# EAGLE design Domino Single Ethernet (EAGLE 6.5.0)
DATABASE: ./../Common/BOM/Domino_DB.txt; DRAWN: M.STEMPIN; REV: E
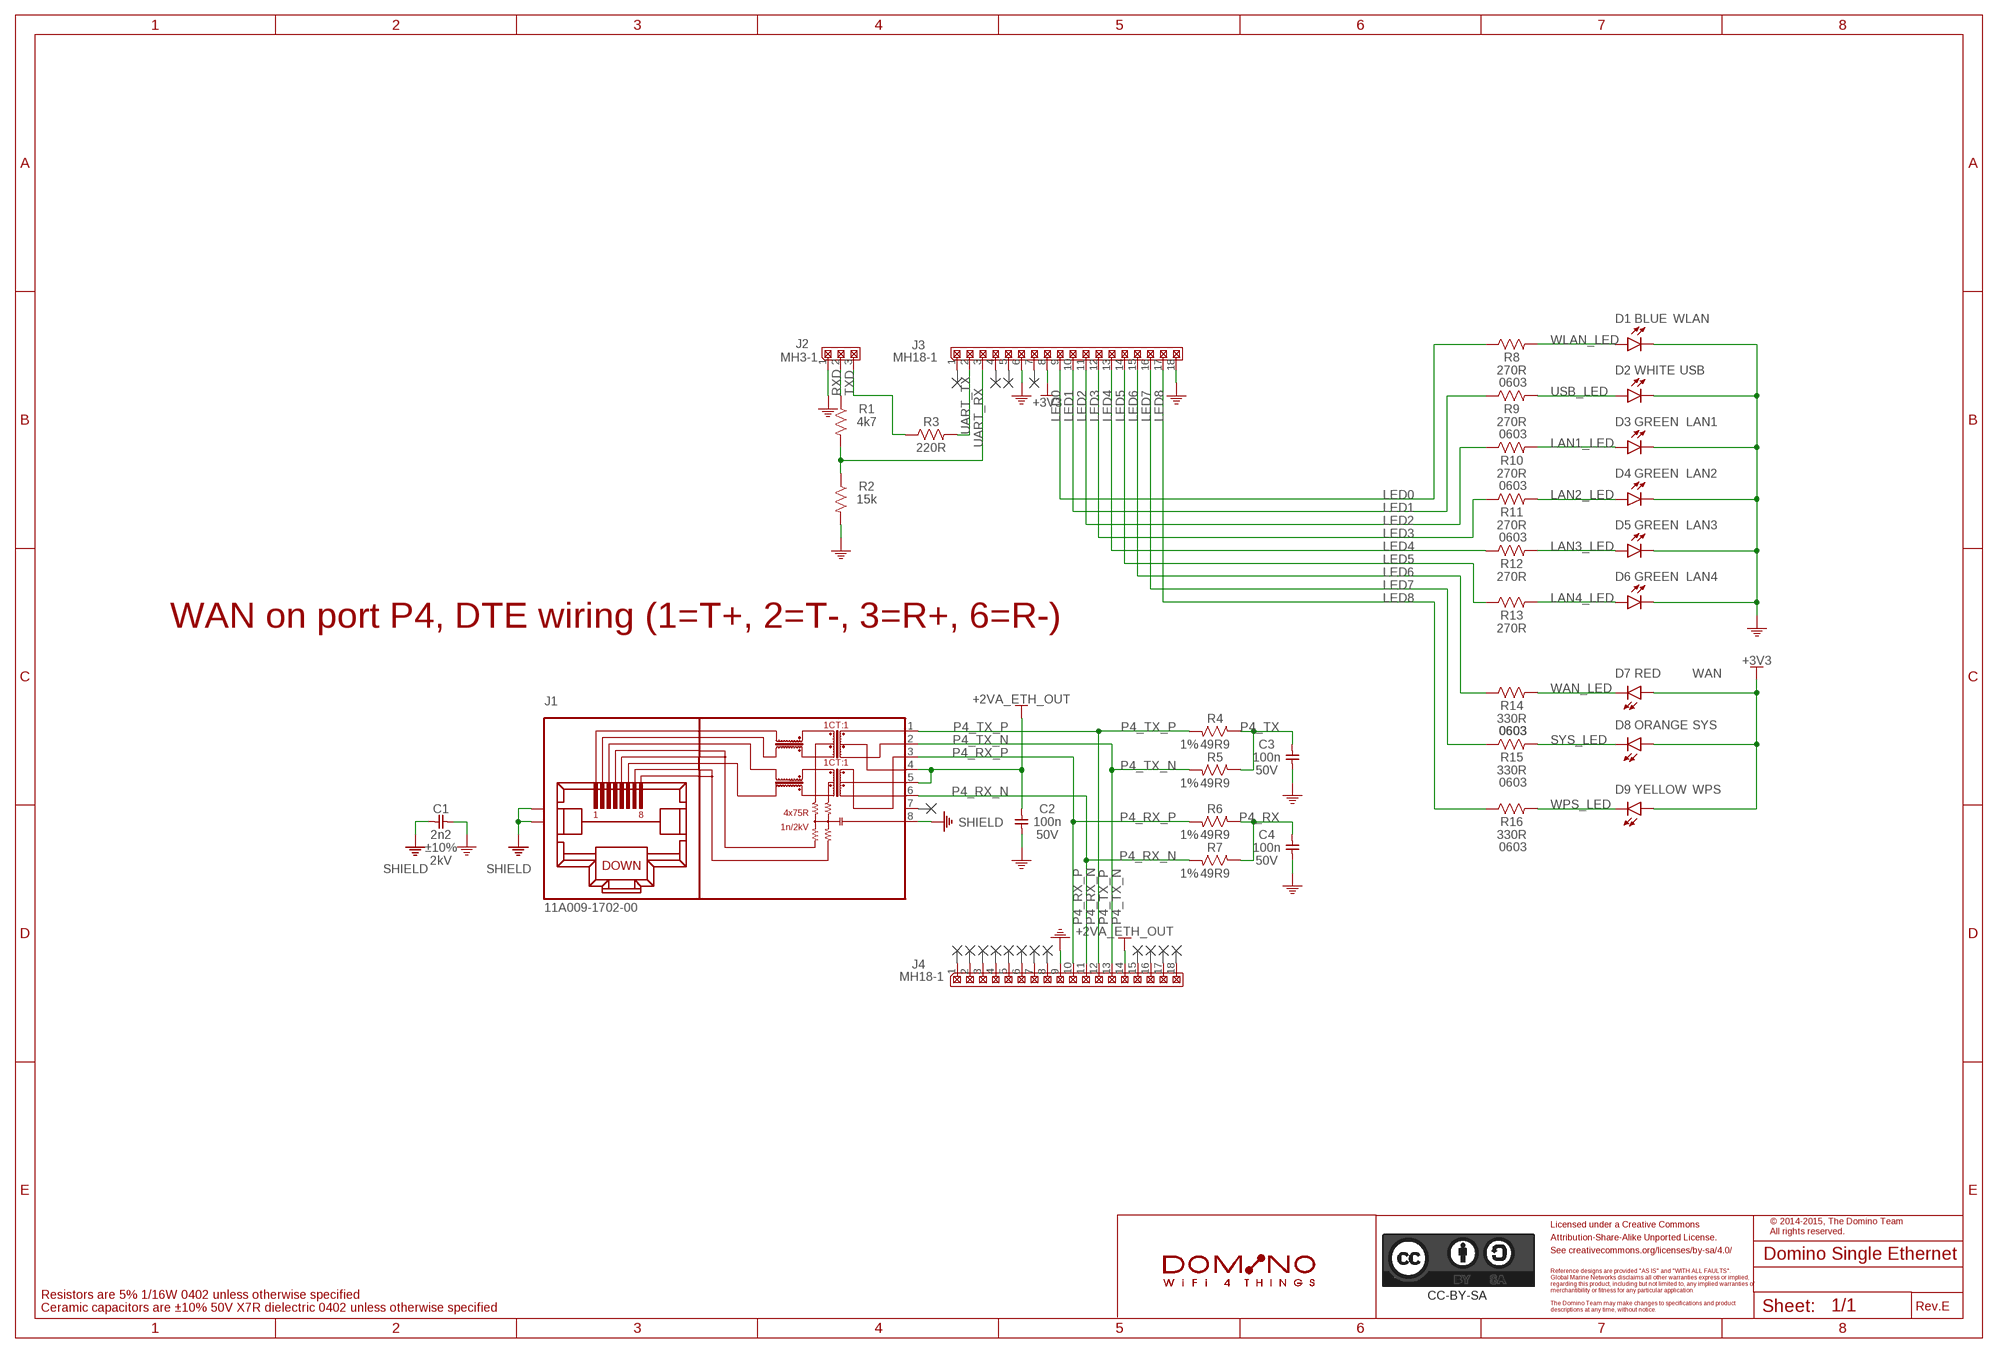
[diagram p0: schematic, sheet 1]
PORT1 (NC): BOM: EXCLUDE
PORT2 (NC): BOM: EXCLUDE
PORT3 (NC): BOM: EXCLUDE
PORT4 (NC): BOM: EXCLUDE
PORT5 (NC): BOM: EXCLUDE
PORT6 (NC): BOM: EXCLUDE
PORT7 (NC): BOM: EXCLUDE
PORT8 (NC): BOM: EXCLUDE
PORT9 (NC): BOM: EXCLUDE
PORT12 (NC): BOM: EXCLUDE
PORT13 (NC): BOM: EXCLUDE
PORT15 (NC): BOM: EXCLUDE
PORT16 (NC): BOM: EXCLUDE
PORT17 (NC): BOM: EXCLUDE
PORT18 (NC): BOM: EXCLUDE
PORT19 (NC): BOM: EXCLUDE
PORT20 (NC): BOM: EXCLUDE

## Parts
C1  2n2  CAP_1206  [C1206]
C2  100n  CAP_0402  [C0402]
C3  100n  CAP_0402  [C0402]
C4  100n  CAP_0402  [C0402]
CC-BY-SA1  CC-BY-SA_LOGO  [CC-BY-SA_LOGO]
D1  BLUE  LED_0603  [LED0603]
D2  WHITE  LED_0603  [LED0603]
D3  GREEN  LED_0603  [LED0603]
D4  GREEN  LED_0603  [LED0603]
D5  GREEN  LED_0603  [LED0603]
D6  GREEN  LED_0603  [LED0603]
D7  RED  LED_0603  [LED0603]
D8  ORANGE  LED_0603  [LED0603]
D9  YELLOW  LED_0603  [LED0603]
J1  11A009-1702-00  [11A009-1702-00]
J2  MH3-1  [MH3-1-0.1]
J3  MH18-1  [MH18-1-0.1]
J4  MH18-1  [MH18-1-0.1]
L1  DOMINO_LOGO  [DOMINO_LOGO]
R1  4k7  RES_0402  [R0402]
R2  15k  RES_0402  [R0402]
R3  220R  RES_0402  [R0402]
R4  49R9  RES_0402  [R0402]
R5  49R9  RES_0402  [R0402]
R6  49R9  RES_0402  [R0402]
R7  49R9  RES_0402  [R0402]
R8  270R  RES_0603  [R0603]
R9  270R  RES_0603  [R0603]
R10  270R  RES_0603  [R0603]
R11  270R  RES_0603  [R0603]
R12  270R  RES_0603  [R0603]
R13  270R  RES_0603  [R0603]
R14  330R  RES_0603  [R0603]
R15  330R  RES_0603  [R0603]
R16  330R  RES_0603  [R0603]

## Nets
+2VA_ETH_OUT: C2.2 J1.4 J1.5 J4.14
+3V3: D7.2(A) D8.2(A) D9.2(A) J3.8
GND: C1.1 C2.1 C3.1 C4.1 D1.1(C) D2.1(C) D3.1(C) D4.1(C) D5.1(C) D6.1(C) J2.1 J3.6 J3.18 J4.9 R2.2
LAN1_LED: D3.2(A) R10.2
LAN2_LED: D4.2(A) R11.2
LAN3_LED: D5.2(A) R12.2
LAN4_LED: D6.2(A) R13.2
LED0: J3.9 R8.1
LED1: J3.10 R9.1
LED2: J3.11 R10.1
LED3: J3.12 R11.1
LED4: J3.13 R12.1
LED5: J3.14 R13.1
LED6: J3.15 R14.1
LED7: J3.16 R15.1
LED8: J3.17 R16.1
P4_RX: C4.2 R6.1 R7.1
P4_RX_N [Ethernet]: J1.6 J4.11 R7.2
P4_RX_P [Ethernet]: J1.3 J4.10 R6.2
P4_TX: C3.2 R4.1 R5.1
P4_TX_N [Ethernet]: J1.2 J4.13 R5.2
P4_TX_P [Ethernet]: J1.1 J4.12 R4.2
RXD: J2.2 R1.1
SHIELD: C1.2 J1.8 J1.SH$1(SHIELD) J1.SH$2(SHIELD)
SYS_LED: D8.1(C) R15.2
TXD: J2.3 R3.1
UART_RX: J3.3 R1.2 R2.1
UART_TX: J3.2 R3.2
USB_LED: D2.2(A) R9.2
WAN_LED: D7.1(C) R14.2
WLAN_LED: D1.2(A) R8.2
WPS_LED: D9.1(C) R16.2
Unconnected: J1.7 J3.1 J3.4 J3.5 J3.7 J4.1 J4.2 J4.3 J4.4 J4.5 J4.6 J4.7 J4.8 J4.15 J4.16 J4.17 J4.18

## Notes on the sheet
- WLAN
- USB
- LAN1
- LAN2
- LAN3
- LAN4
- WAN on port P4, DTE wiring (1=T+, 2=T-, 3=R+, 6=R-)
- WAN
- SYS
- WPS
- Licensed under a Creative Commons
- © 2014-2015, The Domino Team
  All rights reserved.
- Attribution-Share-Alike Unported License.
- See creativecommons.org/licenses/by-sa/4.0/
- Reference designs are provided "AS IS" and "WITH ALL FAULTS".
- Global Marine Networks disclaims all other warranties express or implied,
- regarding this product, including but not limited to, any implied warranties of
- merchantibility or fitness for any particular application.
- Resistors are 5% 1/16W 0402 unless otherwise specified
- The Domino Team may make changes to specifications and product
- Ceramic capacitors are ±10% 50V X7R dielectric 0402 unless otherwise specified | descriptions at any time, without notice. | Rev.

## Library data of the parts
C1 = Domino:CAP_: Capacitor; PARTNO: C1210_2n2_X7R_10%_CER_2kV; SIZE: 1206; TC: X7R; TOL: ±10%; TYPE: CER; VOLT: 2kV
C2-C4 = Domino:CAP_: Capacitor; PARTNO: C0402_100n_X7R_10%_CER_50V; SIZE: 0402; TC: X7R; TOL: ±10%; TYPE: CER; VOLT: 50V
CC-BY-SA1 = Domino:CC-BY-SA_LOGO: Attribution-Share-Alike Unported License See creativecommons.org/licenses/by-sa/3.0/ for details.; BOM: EXCLUDE
D1 = Domino:LED_: LED; PARTNO: LED0603-BLUE
D2 = Domino:LED_: LED; PARTNO: LED0603-WHITE
D3-D6 = Domino:LED_: LED; PARTNO: LED0603-GREEN
D7 D8 = Domino:LED_: LED; PARTNO: LED0603-ORANGE
D9 = Domino:LED_: LED; PARTNO: LED0603-YELLOW
J1 = Domino:11A009-1702-00: Single Port RJ45 Modular Jack with Integrated Magnetics, no LED, 2 Shield Tabs; PARTNO: 11A009-1702-00
J2 = Domino:MH3-1: 3x1 Pin Male Header; PARTNO: MH3-1-0.1
J3 J4 = Domino:MH18-1: 18x1 Pin Male Header; PARTNO: MH18-1-0.1
L1 = Domino:DOMINO_LOGO: Domino Logo; BOM: EXCLUDE
R1 = Domino:RES_: Resistor; PARTNO: R0402_4k7_5%_62.5mW; RATE: 62.5mW; SIZE: 0402; TOL: 5%
R2 = Domino:RES_: Resistor; PARTNO: R0402_15k_5%_62.5mW; RATE: 62.5mW; SIZE: 0402; TOL: 5%
R3 = Domino:RES_: Resistor; PARTNO: R0402_220R_5%_62.5mW; RATE: 62.5mW; SIZE: 0402; TOL: 5%
R4-R7 = Domino:RES_: Resistor; PARTNO: R0402_49R9_1%_62.5mW; RATE: 62.5mW; SIZE: 0402; TOL: 1%
R8-R13 = Domino:RES_: Resistor; PARTNO: R0603_270R_5%_125mW; RATE: 125mW; SIZE: 0603; TOL: 5%
R14-R16 = Domino:RES_: Resistor; PARTNO: R0603_330R_5%_125mW; RATE: 125mW; SIZE: 0603; TOL: 5%

## Net classes
1 Ethernet: width 0.254 mm, clearance 0.152 mm to class 0, clearance 0.152 mm
2 PoE: width 0.457 mm, clearance 0.254 mm to class 0, clearance 0.254 mm to class 1, clearance 0.254 mm

## Board
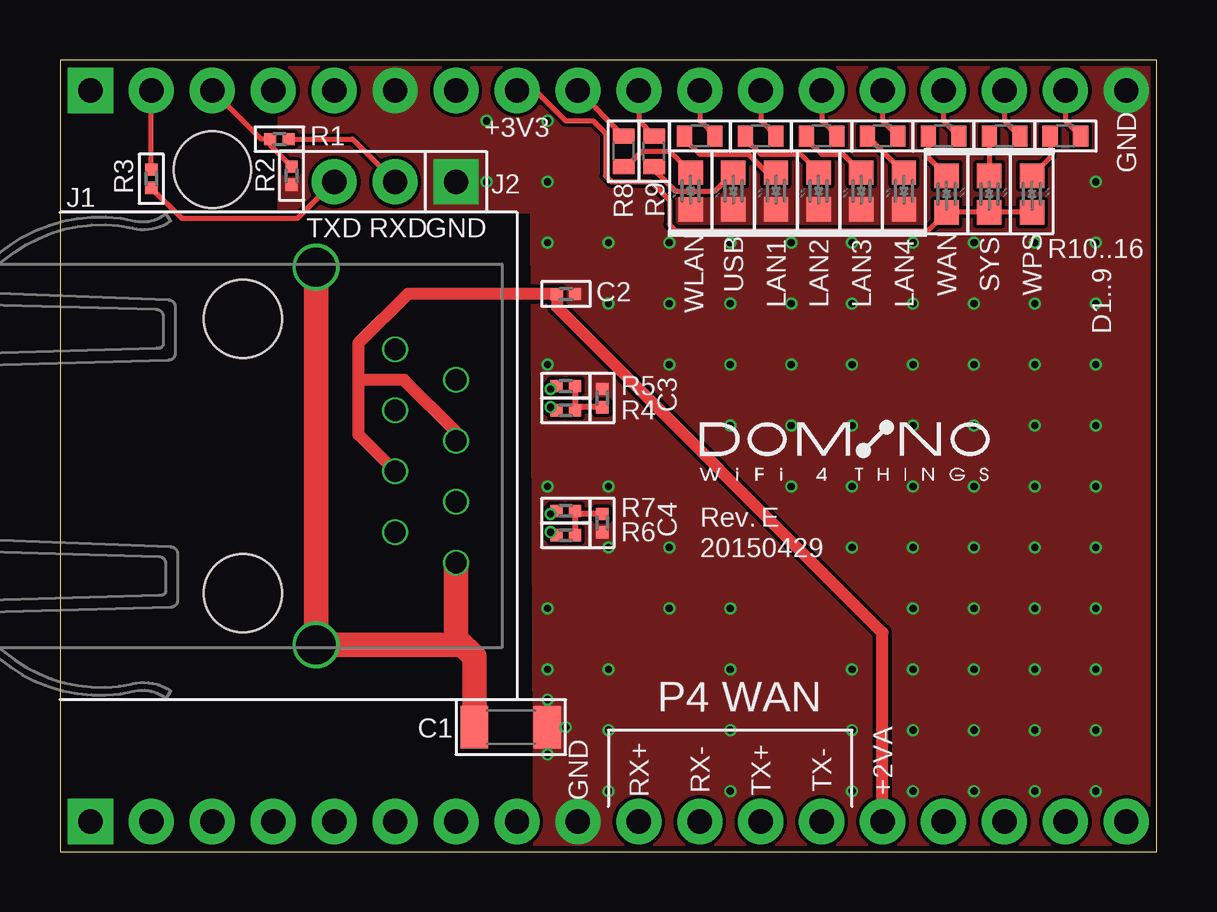
[diagram p1: board, top side]
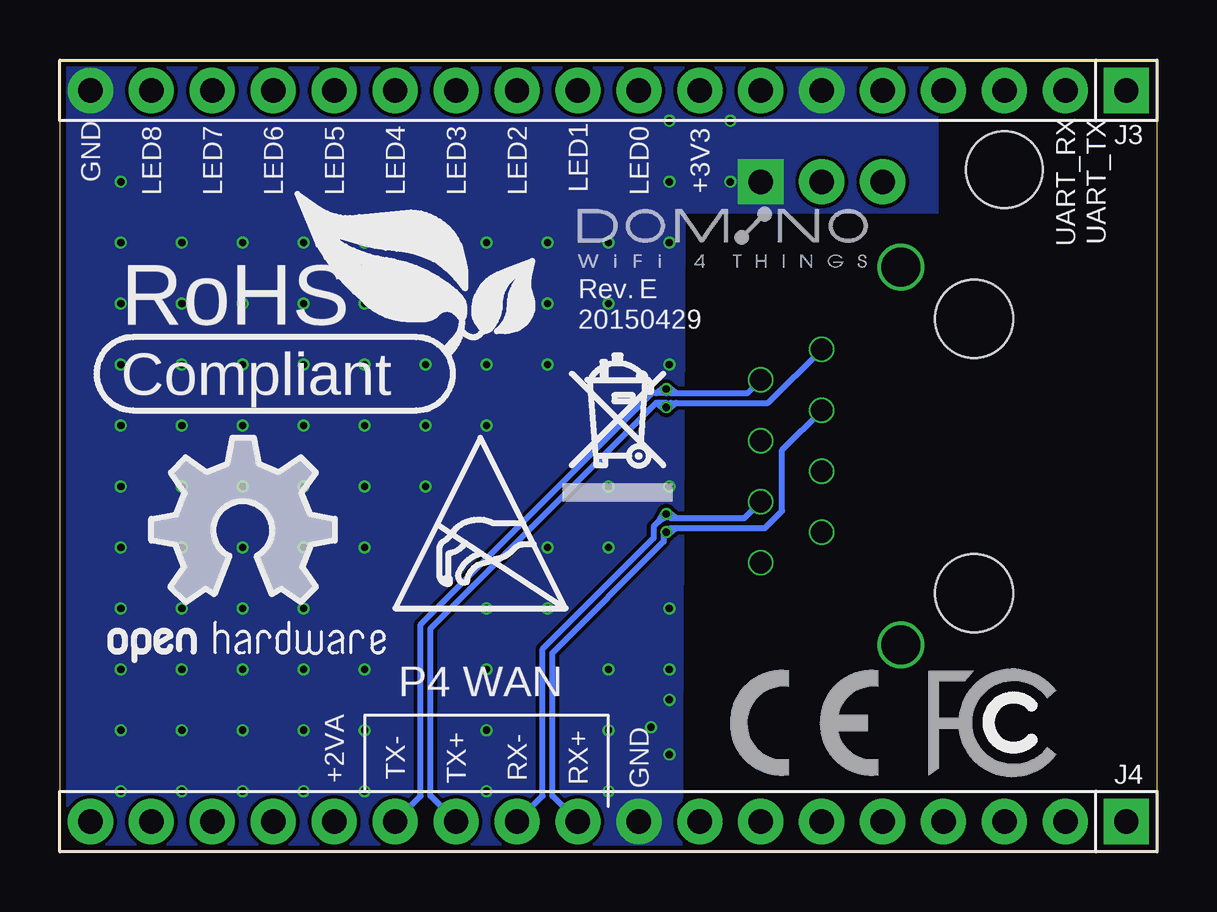
[diagram p2: board, bottom side, seen from below]

Size 45.72 x 33.02 mm. Coordinates in mm from the lower left corner, seen from the top.
Outline: 0,0 45.72,0 45.72,33.02 0,33.02 0,0
Copper layers (1*16): Top 0.043mm / dielectric 1mm / Bottom 0.043mm
Design rules "Domino": minimum track width 0.1mm, minimum drill 0.3mm, track to track 6mil, track to pad 6mil, pad to pad 6mil, via to via 6mil, smd to smd 0mil, copper to edge 0.25mm, drill to drill 0.35mm, minimum pad ring 0.085mm, minimum via ring 0.1mm, stop-mask expansion 0mil, vias tented up to drill 0.45mm, thermal gap 0.2mm
Holes 3.2 mm at 6.35,28.45

### Footprints (pad centres in the part's own frame; a part is rotated, then mirrored left to right if it is on the bottom)
C1206 = smd 1.143 x 1.778: 1 -1.524,0; 2 1.524,0
C0402 = smd 0.508 x 0.508: 1 -0.381,0; 2 0.381,0
LED0603 = smd 1.016 x 1.016: 1 -0.762,0; 2 0.762,0
11A009-1702-00 = drill 0.89: 1 -4.445,6.35; 2 -3.175,8.89; 3 -1.905,6.35; 4 -0.635,8.89; 5 0.635,6.35; 6 1.905,8.89; 7 3.175,6.35; 8 4.445,8.89 | drill 1.63: SH$1 -7.874,3.048; SH$2 7.874,3.048 | hole 3.25: 5.715,0; -5.715,0
MH3-1-0.1 = drill 1.016 pad 1.88 square: 1 -2.54,0 | drill 1.016 pad 1.88: 2 0,0; 3 2.54,0
MH18-1-0.1 = drill 1.016 pad 1.88 square: 1 0,0 | drill 1.016 pad 1.88: 2 2.54,0; 3 5.08,0; 4 7.62,0; 5 10.16,0; 6 12.7,0; 7 15.24,0; 8 17.78,0; 9 20.32,0; 10 22.86,0; 11 25.4,0; 12 27.94,0; 13 30.48,0; 14 33.02,0; 15 35.56,0; 16 38.1,0; 17 40.64,0; 18 43.18,0
R0402 = smd 0.508 x 0.508: 1 -0.381,0; 2 0.381,0
R0603 = smd 0.635 x 0.889: 1 -0.635,0; 2 0.635,0

### Placement (x,y rotation side)
C1  18.8,5.21 180 top
C2  21.09,23.26 180 top
C3  22.61,18.92 270 top
C4  22.61,13.72 90 top
CC-BY-SA1  -5.08,-50.8 0 top  (outside the outline)
D1  26.29,27.56 90 top
D2  28.07,27.56 90 top
D3  29.84,27.56 90 top
D4  31.62,27.56 90 top
D5  33.4,27.56 90 top
D6  35.18,27.56 90 top
D7  36.96,27.43 270 top
D8  38.73,27.43 270 top
D9  40.51,27.43 270 top
DRILEGEND  [DRILEGEND]  80.94,59.83 0 top  (outside the outline)
J1  7.62,16.51 270 top
J2  13.97,27.94 180 top
J3  1.27,31.75 180 bottom
J4  1.27,1.27 180 bottom
L1  -45.72,-48.26 0 top  (outside the outline)
R1  9.14,29.72 180 top
R2  9.65,28.19 270 top
R3  3.81,28.07 90 top
R4  21.08,18.41 180 top
R5  21.08,19.43 180 top
R6  21.08,13.21 180 top
R7  21.08,14.22 180 top
R8  23.5,29.21 270 top
R9  24.77,29.21 270 top
R10  26.67,29.84 180 top
R11  29.21,29.84 180 top
R12  31.75,29.84 180 top
R13  34.29,29.84 180 top
R14  36.83,29.84 180 top
R15  39.37,29.84 180 top
R16  41.91,29.84 180 top
U$3  [A5L-LOC]  -55.88,-62.23 0 top  (outside the outline)
U$4  [DOMINO_LOGO_SMALL]  26.67,16.51 0 top
U$5  [CE_LOGO_SMALL]  17.78,3.17 0 bottom
U$6  [FCC_LOGO_SMALL]  9.53,3.17 0 bottom
U$7  [OPEN_HARDWARE_LOGO]  38.1,13.34 0 bottom
U$8  [RECYCLE_BIN_LOGO]  24.77,14.61 0 bottom
U$9  [ROHS_LOGO]  43.18,19.05 0 bottom
U$11  [DOMINO_LOGO_SMALL]  24.13,25.4 0 bottom
U$13  [ESD_LOGO]  31.75,10.16 0 bottom

### Tracks (layer width: path | path; a pad name or v marks a point on that pad's centre or on a via)
+2VA_ETH_OUT
  Top 0.508: J1.4 16.51,17.53 14.35,19.68 12.45,19.68 | J1.5 12.45,17.4 12.45,19.68 | 12.45,19.68 12.45,21.21 14.5,23.26 C2.2 20.71,22.72 34.29,9.14 J4.14
+3V3
  Top 0.203: D9.2 D8.2 D7.2 36.2,25.91 25.65,25.91 25.4,26.16 25.4,27.18 24.64,27.94 22.99,27.94 22.73,28.19 22.73,29.97 22.23,30.48 21.08,30.48 19.81,31.75 J3.8
GND  (via drill 0.3 pad 0.03)
  other vias: 40.64,2.54 40.64,5.08 40.64,22.86 40.64,25.4 43.18,25.4 43.18,27.94 43.18,22.86 38.1,22.86 38.1,25.4 35.56,25.4 35.56,22.86 35.56,5.08 35.56,2.54 33.02,5.08 33.02,25.4 30.48,25.4 27.94,25.4 27.94,5.08 27.94,2.54 21.08,5.21 22.86,2.54 20.32,4.06 33.02,22.86 30.48,22.86 27.94,22.86 30.48,20.32 33.02,20.32 35.56,20.32 38.1,20.32 40.64,20.32 43.18,20.32 43.18,17.78 40.64,17.78 38.1,17.78 35.56,17.78 33.02,17.78 35.56,15.24 38.1,15.24 40.64,15.24 43.18,15.24 43.18,12.7 40.64,12.7 38.1,12.7 40.64,10.16 43.18,10.16 43.18,7.62 35.56,7.62 33.02,7.62 27.94,7.62 33.02,15.24 33.02,12.7 35.56,12.7 35.56,10.16 38.1,10.16 38.1,7.62 40.64,7.62 38.1,5.08 38.1,2.54 43.18,5.08 43.18,2.54 27.94,10.16 27.94,20.32 30.48,17.78 20.32,6.35 25.4,25.4 22.86,25.4 20.32,25.4 22.86,22.86 25.4,22.86 25.4,20.32 20.32,20.32 27.94,17.78 30.48,15.24 22.86,15.24 20.32,15.24 22.86,12.7 25.4,12.7 25.4,10.16 20.32,10.16 20.32,7.62 22.86,7.62 22.86,5.08 33.02,2.54 20.32,27.94 20.32,30.48 17.78,30.48 17.78,27.94
  pour Top (no thermals): 45.72,33.02 45.72,0 19.81,0 19.68,26.67 9.14,26.67 9.14,33.02
  pour Bottom (no thermals): 45.72,33.02 45.72,0 19.81,0 19.68,26.67 9.14,26.67 9.14,33.02 19.81,33.05
LAN1_LED
  Top 0.203: R10.2 26.04,29.72 26.67,29.08 28.7,29.08 29.46,28.32 D3.2
LAN2_LED
  Top 0.203: R11.2 28.57,29.72 29.21,29.08 30.86,29.08 D4.2
LAN3_LED
  Top 0.203: R12.2 31.11,29.72 31.75,29.08 32.64,29.08 D5.2
LAN4_LED
  Top 0.203: R13.2 D6.2
LED0
  Top 0.203: R8.1 J3.9
LED1
  Top 0.203: J3.10 24.13,30.48 R9.1
LED2
  Top 0.203: J3.11 26.67,30.48 R10.1
LED3
  Top 0.203: J3.12 29.21,30.48 R11.1
LED4
  Top 0.203: J3.13 31.75,30.48 R12.1
LED5
  Top 0.203: J3.14 34.29,30.48 R13.1
LED6
  Top 0.203: J3.15 36.83,30.48 R14.1
LED7
  Top 0.203: J3.16 39.37,30.48 R15.1
LED8
  Top 0.203: J3.17 41.91,30.48 R16.1
P4_RX
  Top 0.254: R6.1 R7.1 21.59,14.1 C4.2
P4_RX_N  (via drill 0.3)
  Top 0.254: R7.2 20.57,14.22 v20.45,14.1
  Bottom 0.254: J4.11 25.6,2.34 25.6,8.47 20.98,13.09 20.98,13.56 20.77,13.78 | v20.45,14.1 20.27,13.92 20.03,13.92 | 20.77,13.78 v20.45,14.1 | 20.03,13.92 17.2,13.92 J1.6 | 20.77,13.78 20.55,14.16 v20.45,14.1 | 20.77,13.78 20.39,13.99 v20.45,14.1 | 20.03,13.92 20.46,13.97 v20.45,14.1 | 20.03,13.92 20.37,14.19 v20.45,14.1
P4_RX_P  (via drill 0.3)
  Top 0.254: R6.2 20.57,13.21 v20.45,13.34
  Bottom 0.254: J4.10 25.2,2.34 25.2,8.3 20.56,12.94 20.56,13.22 v20.45,13.34 | v20.45,13.34 20.28,13.51 20.03,13.51 | 20.03,13.51 16.34,13.51 15.62,14.22 15.62,16.76 J1.3 | 20.03,13.51 20.37,13.24 v20.45,13.34 | 20.03,13.51 20.46,13.46 v20.45,13.34
P4_TX
  Top 0.254: R5.1 R4.1 21.59,18.54 C3.2
P4_TX_N  (via drill 0.3)
  Top 0.254: R5.2 20.57,19.43 v20.45,19.3
  Bottom 0.254: J4.13 30.68,2.34 30.68,9.48 21.04,19.13 20.86,19.13 | v20.45,19.3 20.45,19.13 20.86,19.13 | v20.45,19.3 20.27,19.13 20.03,19.13 | 20.03,19.13 17.07,19.13 J1.2 | 20.86,19.13 20.52,19.4 v20.45,19.3 | 20.86,19.13 20.43,19.18 v20.45,19.3 | 20.03,19.13 20.46,19.18 v20.45,19.3 | 20.03,19.13 20.37,19.4 v20.45,19.3
P4_TX_P  (via drill 0.3)
  Top 0.254: R4.2 20.57,18.41 v20.45,18.54
  Bottom 0.254: J4.12 30.28,2.34 30.28,9.31 20.87,18.72 20.86,18.72 | v20.45,18.54 20.45,18.72 20.86,18.72 | v20.45,18.54 20.27,18.72 20.03,18.72 | 20.03,18.72 16.2,18.72 J1.1 | 20.86,18.72 20.43,18.66 v20.45,18.54 | 20.86,18.72 20.52,18.45 v20.45,18.54 | 20.03,18.72 20.37,18.45 v20.45,18.54 | 20.03,18.72 20.46,18.66 v20.45,18.54
RXD
  Top 0.203: R1.1 12.19,29.72 J2.2
SHIELD
  Top 1.016: J1.SH$1 J1.SH$2 16.51,8.64 16.51,8.89 | J1.8 16.51,8.89 | C1.2 17.27,8.13 16.51,8.89
SYS_LED
  Top 0.203: R15.2 D8.1
TXD
  Top 0.203: R3.1 5.08,26.42 9.91,26.42 J2.3
UART_RX
  Top 0.203: R2.1 8.76,29.46 R1.2 8.38,29.72 J3.3
UART_TX
  Top 0.203: R3.2 J3.2
USB_LED
  Top 0.203: R9.2 24.77,28.45 25.65,27.56 27.3,27.56 D2.2
WAN_LED
  Top 0.203: R14.2 36.2,28.96 D7.1
WLAN_LED
  Top 0.203: R8.2 23.62,28.57 24.26,29.21 25.4,29.21 D1.2
WPS_LED
  Top 0.203: R16.2 41.27,28.96 D9.1

### Text on the board
tPlace: +3V3 | GND | TXD | RXD | GND | USB | WAN | SYS | WPS | WLAN | LAN1 | LAN2 | LAN3 | LAN4 | P4 WAN | +2VA | GND | RX+ | RX- | TX+ | TX-
bPlace: +3V3 | LED0 | LED1 | LED2 | LED3 | LED4 | LED5 | LED6 | LED7 | LED8 | GND | UART_TX | UART_RX | P4 WAN | GND | RX+ | RX- | TX+ | TX- | +2VA
tNames: R10..16 | D1..9 | Rev.
bNames: Rev.
Document: DRILL CHART: TOP TO BOTTOM | LINE WIDTH IMPEDANCE CHART FOR REFERENCE | Class | Ethernet | Type | Diff Coated Coplanar Waveguide With Ground 1B | Layer | Impedance | Trace Width | Trace Separation | Ground Separation | TOP, / BOTTOM | 100 Ohms | 10 mils | 6 mils | 6 mils | STACK-UP FOR REFERENCE | LAYER 1 L1 TOP | 18 UM CU + 12.5 UM PLATING (30.5 UM) | 1.061 MM+/-10% | CORE | 1.0 MM CORE FR-4 LG 135 / INCLUDING COPPER | LAYER 4 L16 BOTTOM | 18 UM CU + 12.5 UM PLATING (30.5 UM) | NOTES: | 1. PRINTED CIRCUIT BOARD MADE FROM NEMA GRADE FR-4 TG 135 EPOXY / LAMINATE WITH 18 UM COPPER PLATING AND 1 MM THICKNESS. | 2. ALL DIMENSIONS ARE GIVEN IN MILLIMETERS EXCEPT TRACE WIDTH/SPACE. | 3. CIRCUIT PATHS ARE FOR REFERENCE ONLY. | 4. HOLE SIZES SHOWN ARE FINISHED DIAMETERS AFTER PLATING. | 5. BOARD PLATED USING REFLOW OR SIMILAR METHOD. | 6. BOARD TO HAVE WHITE SOLDER MASK ON PLATED SURFACES USING WET / FILM SR100 OR SR1010 EPOXY. / EQUIVALENT WET OR DRY FILM MAY BE USED. | 7. SILKSCREEN BOARD USING BLACK INK. DISTORTION OF SILKSCREEN / IS ACCEPTABLE OVER TRACES. EPOXY INK ON PLATED LANDS IS NOT / ACCEPTABLE | 8. THE FOLLOWING INFORMATION APPLIES TO THIS BOARD: | * 2 COPPER LAYERS | * 1 MM BOARD THICKNESS | * REQUIRES TOP AND BOTTOM SIDE SILKSCREENS | © 2014-2015, The Domino Team. / All rights reserved. | Licensed under a Creative Commons / Attribution-Share-Alike Unported License. / See creativecommons.org/licenses/by-sa/4.0/ | Reference designs are provided "AS IS" and "WITH ALL FAULTS". / The Domino Team disclaims all other warranties express or implied, / regarding this product, including but not limited to, any implied warranties of / merchantibility or fitness for any particular application. | The Domino Team may make changes to specifications and product descriptions / at any time, without notice. | Rev.
DrillLegend: LAYER-STACK
DrillLegend_01-16: 01-16
DrillLegend_01-20: 01-20
Pinout: TXD | RXD | GND | UART_TX | UART_RX | +3V3 | LED0 | LED1 | ELD2 | LED3 | LED4 | LED5 | LED6 | LED7 | LED8 | GND | GND | P4_RX+ | P4_RX- | P4_TX+ | P4_TX- | +2VA_ETH_OUT | Pinout (.PIN)
Component_side: Component Side (.CMP)
Solder_side: Solder side (.SOL)
Silk_screen_CMP: Silk screen CMP (.PLC)
Silk_screen_SOL: Silk screen SOL (.PLS)
Solder_stop_mask_CMP: Solder stop mask CMP (.STC)
Solder_stop_mask_SOL: Solder stop mask SOL (.STS)
Cream_frame_CMP: Cream frame CMP (.CRC)
Cream_frame_SOL: Cream frame SOL (.CRS)
Drill_data: Drill data (.DRD)
Component_Assembly_CMP: Component Assembly CMP (.ASC)
Component_Assembly_SOL: Component Assembly SOL (.ASS)
Outline: Outline (.OLN)